# EAGLE design standoff_board_v10 (EAGLE 7.2.0)
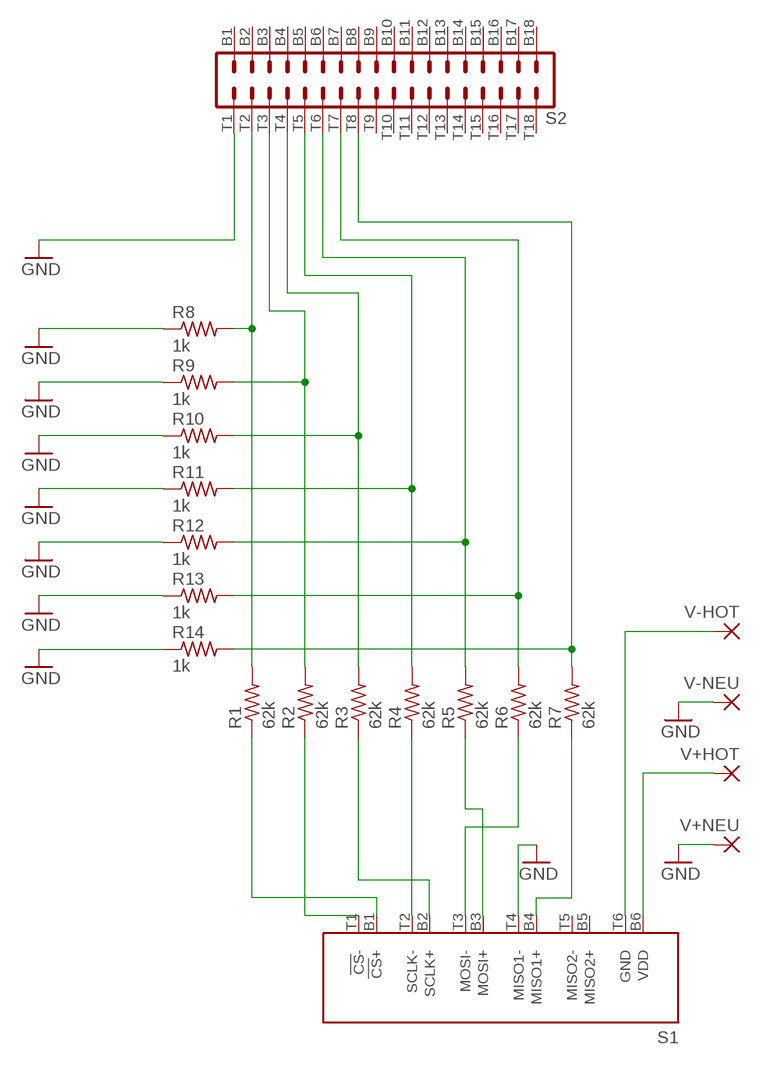
[diagram p0: schematic, sheet 1]

## Parts
R1  62k  R-US_0204/7  [0204/7]
R2  62k  R-US_0204/7  [0204/7]
R3  62k  R-US_0204/7  [0204/7]
R4  62k  R-US_0204/7  [0204/7]
R5  62k  R-US_0204/7  [0204/7]
R6  62k  R-US_0204/7  [0204/7]
R7  62k  R-US_0204/7  [0204/7]
R8  1k  R-US_0204/7  [0204/7]
R9  1k  R-US_0204/7  [0204/7]
R10  1k  R-US_0204/7  [0204/7]
R11  1k  R-US_0204/7  [0204/7]
R12  1k  R-US_0204/7  [0204/7]
R13  1k  R-US_0204/7  [0204/7]
R14  1k  R-US_0204/7  [0204/7]
S1  RHD2000-CABLE-DAQ-SIDE  [OMNETICS_PZN-12-AA]
S2  OMNETICS_A79025  [OMNETICS_A79025]
V+HOT  2,54/1,1  [2,54/1,1]
V+NEU  2,54/1,1  [2,54/1,1]
V-HOT  2,54/1,1  [2,54/1,1]
V-NEU  2,54/1,1  [2,54/1,1]

## Nets
A1POST: R1.2 R8.2 S2.T2
A1PRE: R1.1 S1.B1(!CS!+)
A2POST: R2.2 R9.2 S2.T3
A2PRE: R2.1 S1.T1(!CS!-)
A3POST: R3.2 R10.2 S2.T4
A3PRE: R3.1 S1.B2(SCLK+)
A4POST: R4.2 R11.2 S2.T5
A4PRE: R4.1 S1.T2(SCLK-)
A5POST: R5.2 R12.2 S2.T6
A5PRE: R5.1 S1.B3(MOSI+)
A6POST: R6.2 R13.2 S2.T7
A6PRE: R6.1 S1.T3(MOSI-)
A7POST: R7.2 R14.2 S2.T8
A7PRE: R7.1 S1.B4(MISO1+)
GND: R8.1 R9.1 R10.1 R11.1 R12.1 R13.1 R14.1 S1.T4(MISO1-) S2.T1 V+NEU.1(P) V-NEU.1(P)
V+HOT: S1.B6(VDD) V+HOT.1(P)
V-HOT: S1.T6(GND) V-HOT.1(P)
Unconnected: S1.B5(MISO2+) S1.T5(MISO2-) S2.B1 S2.B2 S2.B3 S2.B4 S2.B5 S2.B6 S2.B7 S2.B8 S2.B9 S2.B10 S2.B11 S2.B12 S2.B13 S2.B14 S2.B15 S2.B16 S2.B17 S2.B18 S2.T9 S2.T10 S2.T11 S2.T12 S2.T13 S2.T14 S2.T15 S2.T16 S2.T17 S2.T18

## Library data of the parts
R1-R14 = resistor:R-US_: RESISTOR, American symbol
S1 = RHD2000:RHD2000-CABLE-DAQ-SIDE: Omnetics A79623 PZN-12-AA connector for SPI interface (controller side)
S2 = RHD2000:OMNETICS_A79025: Omnetics A79025 36-pin connector
V+HOT V+NEU V-HOT V-NEU = wirepad:2,54/1,1: THROUGH-HOLE PAD

## Board
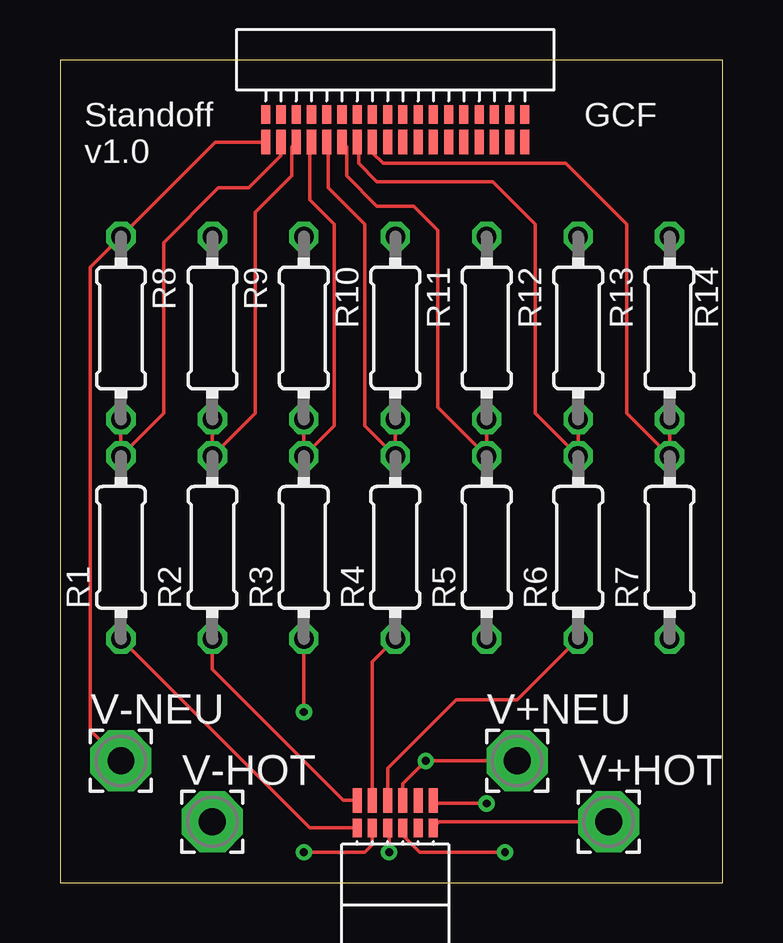
[diagram p1: board, top side]
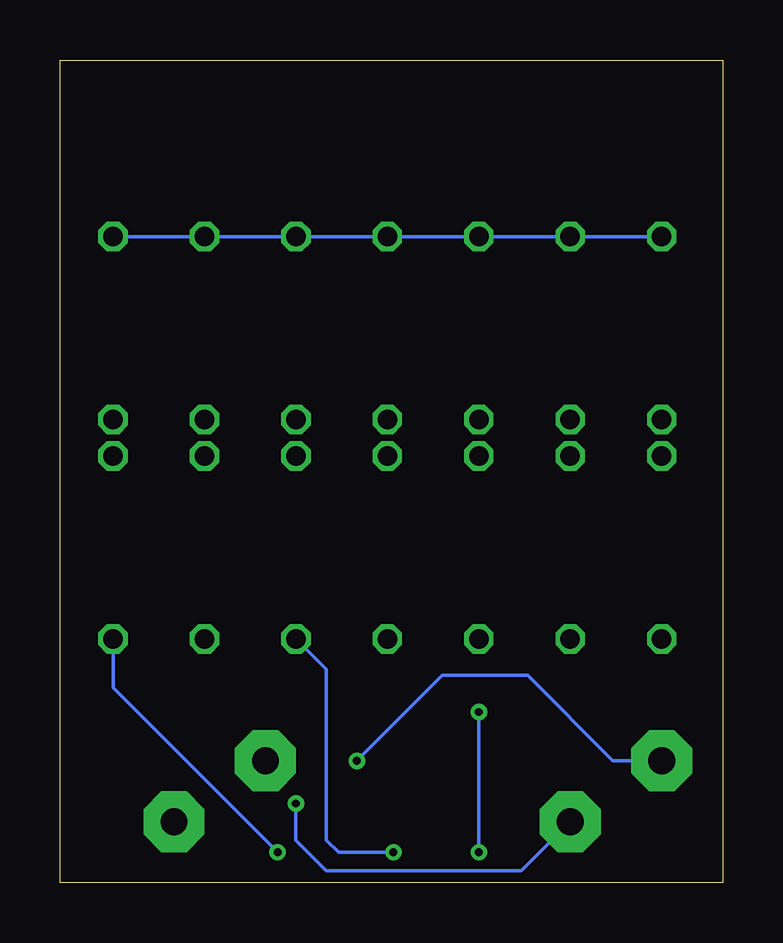
[diagram p2: board, bottom side, seen from below]

Size 27.61 x 34.28 mm. Coordinates in mm from the lower left corner, seen from the top.
Outline: 0,0 27.61,0 27.61,34.28 0,34.28 0,0
Copper layers (1*16): Top 0.0356mm / dielectric 1.5011mm / Bottom 0.0356mm
Design rules "LaenPCBOrder": minimum track width 6mil, minimum drill 13mil, track to track 6mil, track to pad 6mil, pad to pad 6mil, via to via 6mil, smd to smd 6mil, copper to edge 15mil, drill to drill 6mil, minimum pad ring 7mil, minimum via ring 7mil, stop-mask expansion 3mil, vias tented up to drill 0mil, thermal gap 10mil

### Footprints (pad centres in the part's own frame; a part is rotated, then mirrored left to right if it is on the bottom)
0204/7 = drill 0.813 octagon: 1 -3.81,0; 2 3.81,0
OMNETICS_PZN-12-AA = smd 0.381 x 0.762: B1 1.587,-1.016; B2 0.953,-1.016; B3 0.318,-1.016; B4 -0.318,-1.016; B5 -0.953,-1.016; B6 -1.587,-1.016 | smd 0.381 x 1.016: T1 1.587,-2.159; T2 0.953,-2.159; T3 0.318,-2.159; T4 -0.318,-2.159; T5 -0.953,-2.159; T6 -1.587,-2.159
OMNETICS_A79025 = smd 0.381 x 0.762: B1 -5.397,-1.016; B2 -4.763,-1.016; B3 -4.128,-1.016; B4 -3.493,-1.016; B5 -2.857,-1.016; B6 -2.223,-1.016; B7 -1.587,-1.016; B8 -0.953,-1.016; B9 -0.318,-1.016; B10 0.318,-1.016; B11 0.953,-1.016; B12 1.587,-1.016; B13 2.223,-1.016; B14 2.857,-1.016; B15 3.493,-1.016; B16 4.128,-1.016; B17 4.763,-1.016; B18 5.397,-1.016 | smd 0.381 x 1.016: T1 -5.397,-2.159; T2 -4.763,-2.159; T3 -4.128,-2.159; T4 -3.493,-2.159; T5 -2.857,-2.159; T6 -2.223,-2.159; T7 -1.587,-2.159; T8 -0.953,-2.159; T9 -0.318,-2.159; T10 0.318,-2.159; T11 0.953,-2.159; T12 1.587,-2.159; T13 2.223,-2.159; T14 2.857,-2.159; T15 3.493,-2.159; T16 4.128,-2.159; T17 4.763,-2.159; T18 5.397,-2.159
2,54/1,1 = drill 1.118 pad 2.54 octagon: 1 0,0

### Placement (x,y rotation side)
R1  2.54,13.97 90 top
R2  6.35,13.97 90 top
R3  10.16,13.97 90 top
R4  13.97,13.97 90 top
R5  17.78,13.97 90 top
R6  21.59,13.97 90 top
R7  25.4,13.97 90 top
R8  2.54,23.11 270 top
R9  6.35,23.11 270 top
R10  10.16,23.11 270 top
R11  13.97,23.11 270 top
R12  17.78,23.11 270 top
R13  21.59,23.11 270 top
R14  25.4,23.11 270 top
S1  13.97,1.27 180 top
S2  13.97,33.02 0 top
V+HOT  22.86,2.54 0 top
V+NEU  19.05,5.08 0 top
V-HOT  6.35,2.54 0 top
V-NEU  2.54,5.08 0 top

### Tracks (layer width: path | path; a pad name or v marks a point on that pad's centre or on a via)
A1POST
  Top 0.152: R8.2 R1.2 4.32,19.56 4.32,26.67 6.6,28.96 7.87,28.96 9.21,30.29 S2.T2
A1PRE
  Top 0.152: S1.B1 10.41,2.29 R1.1
A2POST
  Top 0.152: R9.2 R2.2 8.13,19.56 8.13,27.94 9.65,29.46 9.65,30.67 S2.T3
A2PRE
  Top 0.152: S1.T1 11.81,3.43 6.35,8.89 R2.1
A3POST
  Top 0.152: R10.2 R3.2 11.43,19.05 11.43,27.43 10.41,28.45 10.41,30.8 S2.T4
A3PRE  (via drill 0.33 pad 0.41)
  Top 0.152: S1.B2 13.02,1.59 12.7,1.27 v10.16,1.27 | R3.1 v10.16,7.11
  Bottom 0.152: v10.16,7.11 v10.16,1.27
A4POST
  Top 0.152: R11.2 R4.2 12.7,19.05 12.7,27.43 11.18,28.96 11.18,30.8 S2.T5
A4PRE
  Top 0.152: S1.T2 13.02,9.21 R4.1
A5POST
  Top 0.152: R12.2 R5.2 15.75,19.81 15.75,27.18 14.73,28.19 13.21,28.19 11.94,29.46 11.94,30.67 S2.T6
A5PRE  (via drill 0.33 pad 0.41)
  Top 0.152: S1.B3 13.72,2.29 v13.72,1.27
  Bottom 0.152: R5.1 16.51,8.89 16.51,1.78 16,1.27 v13.72,1.27
A6POST
  Top 0.152: R13.2 R6.2 19.81,19.56 19.81,27.43 18.03,29.21 13.21,29.21 12.45,29.97 12.45,30.8 S2.T7
A6PRE
  Top 0.152: S1.T3 13.65,4.76 16.51,7.62 19.05,7.62 R6.1
A7POST
  Top 0.152: R14.2 R7.2 23.62,19.56 23.62,27.43 21.08,29.97 13.46,29.97 13.02,30.42 S2.T8
A7PRE  (via drill 0.33 pad 0.41)
  Top 0.152: S1.B4 14.29,1.97 14.99,1.27 v18.54,1.27
  Bottom 0.152: R7.1 25.4,8.13 v18.54,1.27
GND  (via drill 0.33 pad 0.41)
  Top 0.152: V-NEU.1 1.27,6.35 1.27,25.65 R8.1 6.48,30.86 S2.T1 | S1.T4 14.29,4.13 v15.24,5.08 V+NEU.1
  Bottom 0.152: R8.1 R9.1 R10.1 R11.1 R12.1 R13.1 R14.1 | V-NEU.1 4.57,5.08 8.13,8.64 11.68,8.64 v15.24,5.08
V+HOT
  Top 0.152: S1.B6 15.81,2.54 V+HOT.1
V-HOT  (via drill 0.33 pad 0.41)
  Top 0.152: v17.78,3.3 15.68,3.3 S1.T6
  Bottom 0.152: V-HOT.1 8.38,0.51 16.51,0.51 17.78,1.78 v17.78,3.3

### Text on the board
tPlace: GCF | Standoff / v1.0